# Altium schematic sheet connectors.SchDoc: USB and Buzzer
size A3; Author: Daniele Basile <asterix24@gmail.com>; Organization: Develer s.r.l.; Address3: Firenze; Address4: ITALY; Revision: A; SheetNumber: 1; SheetTotal: 1
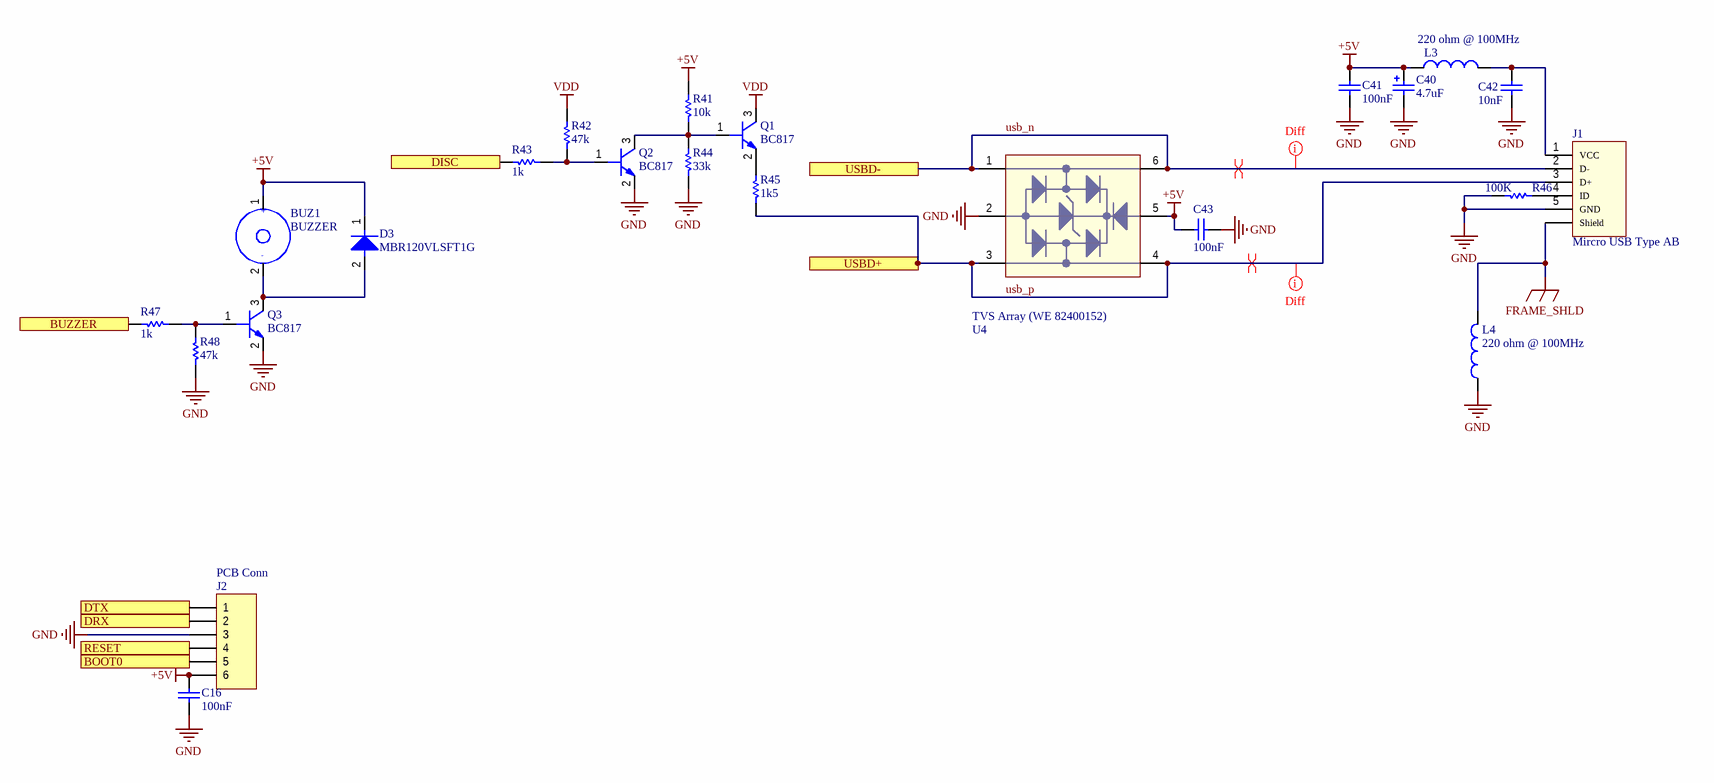
[diagram p0: connectors.SchDoc]

## Parts
BUZ1  BUZZER  [BUZZER_7.5x7.5_SMD]
C16  100nF  [0603_[1608]]
C40  4.7uF  [1206_[3216]]
C41  100nF  [0603_[1608]]
C42  10nF  [0603_[1608]]
C43  100nF  [0603_[1608]]
D3  MBR120VLSFT1G  [SOD-123]
J1  Mircro USB Type AB  [USB_MICRO_AB_SMD]
J2  PCB Conn  [HEADER_1X6_2.54MM_ANGLED_THD]
L3  220 ohm @ 100MHz  [0805_[2012]]
L4  220 ohm @ 100MHz  [0805_[2012]]
Q1  BC817  [SOT-23]
Q2  BC817  [SOT-23]
Q3  BC817  [SOT-23]
R41  10k  [0603_[1608]]
R42  47k  [0603_[1608]]
R43  1k  [0603_[1608]]
R44  33k  [0603_[1608]]
R45  1k5  [0603_[1608]]
R46  100K  [0603_[1608]]
R47  1k  [0603_[1608]]
R48  47k  [0603_[1608]]
U4  TVS Array (WE 82400152)  [SOT-563]

## Ports
BOOT0, BUZZER, DISC, DRX, DTX, RESET, USBD+, USBD-

## Nets
+5V: BUZ1.1 C16.2 C40.1 C41.1 C43.2 D3.1(K) J2.6 L3.1 R41.1 U4.5
FRAME_SHLD: J1.Shell(Shield) L4.2
GND: C16.1 C40.2 C41.2 C42.2 C43.1 J1.5(GND) J2.3 L4.1 Q2.2(E) Q3.2(E) R44.2 R46.2 R48.2 U4.2
VDD: Q1.3(C) R42.1
BOOT0: J2.5 ; port BOOT0
BUZZER: R47.2 ; port BUZZER
DISC: R43.2 ; port DISC
DRX: J2.2 ; port DRX
DTX: J2.1 ; port DTX
RESET: J2.4 ; port RESET
usb_n: J1.2(D-) U4.1 U4.6 ; port USBD-
usb_p: J1.3(D+) R45.2 U4.3 U4.4 ; port USBD+
NetBUZ1_2: BUZ1.2 D3.2(A) Q3.3(C)
NetC42_1: C42.1 J1.1(VCC) L3.2
NetJ1_4: J1.4(ID) R46.1
NetQ1_1: Q1.1(B) Q2.3(C) R41.2 R44.1
NetQ1_2: Q1.2(E) R45.1
NetQ2_1: Q2.1(B) R42.2 R43.1
NetQ3_1: Q3.1(B) R47.1 R48.1

## Layout directives
net class usb_diff: usb_n, usb_p
differential pair: usb_n, usb_p

## Notes on the sheet
- Title:
- Project:
- Status:
- Author:
- License:
- Rev:
- Size:
- A3
- asterix24@gmail.com
- Ing. Daniele Basile
- File:
- Date:
- Time:
- Sheet
- of
- (in symbol BUZZER) +; -

## Library data of the parts
C16 C43 = Cap: Ceramic X7R 50V; Value: 100pF; Published: 8-Jun-2000; LatestRevisionDate: 17-Jul-2002; LatestRevisionNote: Re-released for DXP Platform.; PackageReference: RAD-0.3; Publisher: Altium Limited; PackageDescription: Radial Cap, Thru-Hole; 2 Leads; 0.3 in Pin Spacing
C40 = Cap Pol1: Ceramic X7R 16V; Value: 10uF; Published: 8-Jun-2000; Revision: July-2002: Re-released for DXP Platform.; Publisher: Altium Limited
C41 = Cap: Ceramic X7R 50V; Value: 10nF; Published: 8-Jun-2000; Revision: July-2002: Re-released for DXP Platform.; Publisher: Altium Limited
C42 = Cap: Ceramic X7R 50V; Published: 8-Jun-2000; Revision: July-2002: Re-released for DXP Platform.; Publisher: Altium Limited; Value: 10nF
D3 = Diode: Diode Schottky  low Vf, If 1A (PMEG3010ER; MBRX120LF)
J1 = USB_MICRO_TypeAB: Micro USB 2.0 Type AB Horizontal WR-COM; Part Number: 629105150921; Interface Type: Type AB; Gender: Receptacle; ComponentLink1Description: Manufacturer; ComponentLink1URL: http://www.we-online.de; ComponentLink2Description: Datasheet; ComponentLink2URL: http://katalog.we-online.de/em/datasheet/629105150921.pdf; Published Date: April 2017; Publisher: Wurth Elektronik; Sub-Family: Micro USB 2.0; Type: Horizontal; Construction: SMT
J2 = Header 6: Header, 6-Pin; LatestRevisionDate: 17-Jul-2002; LatestRevisionNote: Re-released for DXP Platform.; Publisher: Altium Limited
L3 L4 = Inductor: WE 742792022
Q1-Q3 = BC817: BJT NPN
R41 R42 R44 R45 R48 = Res1: Resistor; Value: 1K; Published: 8-Jun-2000; Revision: July-2002: Re-released for DXP Platform.; Publisher: Altium Limited
R43 R47 = Res1: Resistor; Published: 8-Jun-2000; Revision: July-2002: Re-released for DXP Platform.; Publisher: Altium Limited; Value: 1K
R46 = Resistor_ST: Resistor; Value: 10K
U4 = TVS_Diode_Array